# Altium schematic sheet RTC.SchDoc
size A
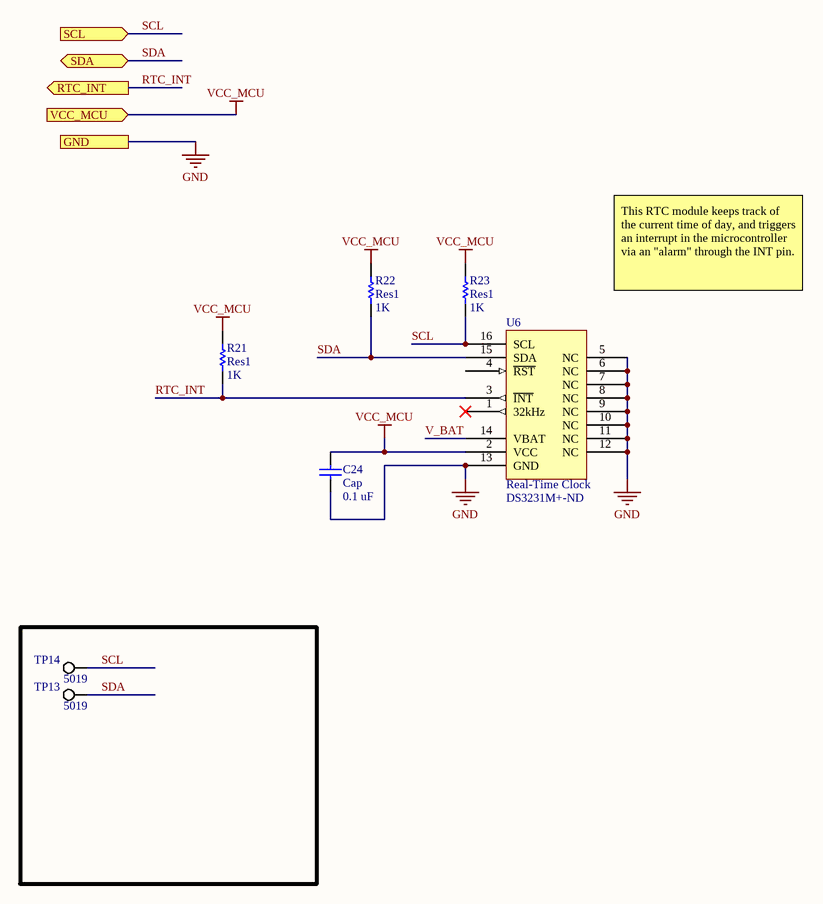
[diagram p0: RTC.SchDoc]

## Parts
C24  Cap  value 0.1 uF  [1608[0603]]
R21  Res1  value 1K  [J1-0603]
R22  Res1  value 1K  [J1-0603]
R23  Res1  value 1K  [J1-0603]
TP13  5019  [KSTN-5019_V]  (no BOM)
TP14  5019  [KSTN-5019_V]  (no BOM)
U6  Real-Time Clock  Supplier Part Number 1: DS3231M+-ND  [DS3231 SO16]

## Ports
GND, RTC_INT (out), SCL (in), SDA (bidir), VCC_MCU (in)

## Nets
GND: C24.2 U6.5(NC) U6.6(NC) U6.7(NC) U6.8(NC) U6.9(NC) U6.10(NC) U6.11(NC) U6.12(NC) U6.13(GND) ; port GND
VCC_MCU: C24.1 R21.2 R22.2 R23.2 U6.2(VCC) ; port VCC_MCU
RTC_INT: R21.1 U6.3(~{INT}) ; port RTC_INT
SCL: R23.1 TP14.1 U6.16(SCL) ; port SCL
SDA: R22.1 TP13.1 U6.15(SDA) ; port SDA
V_BAT: U6.14(VBAT)

Not connected (* = marked no-connect by the designer): U6 1(32kHz)* 4(~{RST})

## Notes on the sheet
- This RTC module keeps track of the current time of day, and triggers an interrupt in the microcontroller via an "alarm" through the INT pin.

## Library data of the parts
C24 = Cap: Capacitor; Published: 8-Jun-2000; LatestRevisionDate: 17-Jul-2002; LatestRevisionNote: Re-released for DXP Platform.; PackageReference: RAD-0.3; Publisher: Altium Limited; PackageDescription: Radial Cap, Thru-Hole; 2 Leads; 0.3 in Pin Spacing
R21-R23 = Res1: Resistor; Published: 8-Jun-2000; LatestRevisionDate: 17-Jul-2002; LatestRevisionNote: Re-released for DXP Platform.; PackageReference: AXIAL-0.3; Publisher: Altium Limited; PackageDescription: Axial Device, Thru-Hole; 2 Leads; 0.3 in Pin Spacing
TP13 TP14 = CMP-1672-00008-1: Test Point, 1 Position SMD, RoHS, Tape and Reel; ComponentLink1Description: Manufacturer URL; Package Quantity: 1000; DatasheetVersion: 03/2014; Packaging: Tape and Reel; ComponentLink2URL: http://www.keyelco.com/product-pdf.cfm?p=1357; ComponentLink1URL: http://www.keyelco.com/; Mount: Surface Mount; Contact Plating: Silver; PackageDescription: 1-Pin Surface Mount Device, Body 3.81 x 2.03 mm; Pins: 1; RoHSCompliant: True; Mounting Technology: Surface Mount; ComponentLink2Description: Datasheet; PackageReference: 5019
U6 = DS3231: Extremely Accurate I2C-Integrated RTC/TCXO/Crystal; Manufacturer: Maxim; Manufacturer Part Number: DS3231M+; Time Format: HH:MM:SS; Operating Supply Voltage: 3.3V; Max Supply Voltage: 5.5V; Min Supply Voltage: 2.3V; Interface: 2-Wire,I2C,Serial; Date Format: YY-MM-DD-dd; Supplier 1: Digi-Key; RoHS: Yes; Stock 1: 65; Pricing 1: 1 = 7.98000, 10 = 7.58100, 25 = 6.99000, 50 = 6.64060, 100 = 6.01000, 250 = 5.70952, 1000 = 4.27822 (USD); Mount: Surface Mount; Case/Package: SOIC; Number of Pins: 16; Min Operating Temperature: -40°C; Max Operating Temperature: 85°C; Logic Function: Clock; Package Quantity: 46; Packaging: Rail/Tube; Radiation Hardening: No; ComponentLink1URL: http://www.mouser.com/ds/2/256/DS3231M-35560.pdf?src-supplier=Mouser; ComponentLink1Description: http://www.mouser.com/ds/2/256/DS3231M-35560.pdf?src-supplier=Mouser; ComponentLink2URL: http://datasheets.maximintegrated.com/en/ds/DS3231M.pdf?src-supplier=Digi-Key; ComponentLink2Description: http://datasheets.maximintegrated.com/en/ds/DS3231M.pdf?src-supplier=Digi-Key; ComponentLink3URL: http://datasheet.iiic.cc/maxim/DS3231M_.pdf?src-supplier=IIIC; ComponentLink3Description: http://datasheet.iiic.cc/maxim/DS3231M_.pdf?src-supplier=IIIC